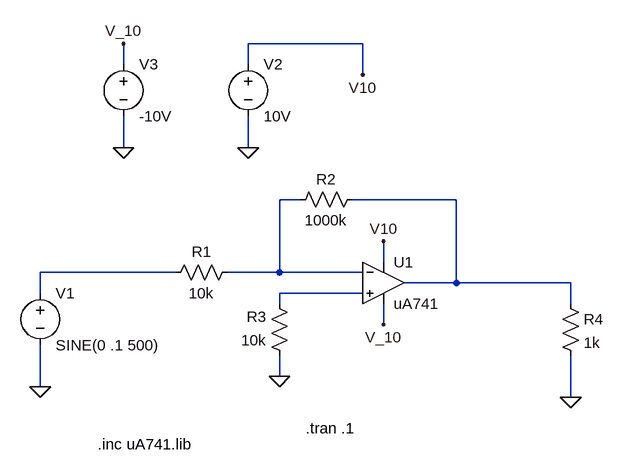
[diagram p0: schematic AOP2-uA741.asc]
AOP2-uA741.asc, the LTspice schematic file:
Version 4
SHEET 1 880 680
WIRE 432 -304 256 -304
WIRE 64 -272 64 -304
WIRE 256 -272 256 -304
WIRE 432 -256 432 -304
WIRE 64 -144 64 -192
WIRE 256 -144 256 -192
WIRE 336 -64 304 -64
WIRE 576 -64 416 -64
WIRE 464 32 464 0
WIRE 144 48 -64 48
WIRE 304 48 304 -64
WIRE 304 48 224 48
WIRE 432 48 304 48
WIRE 576 64 576 -64
WIRE 576 64 496 64
WIRE 752 64 576 64
WIRE -64 80 -64 48
WIRE 432 80 304 80
WIRE 304 96 304 80
WIRE 752 96 752 64
WIRE 464 128 464 96
WIRE 304 208 304 176
WIRE -64 224 -64 160
WIRE 752 240 752 176
FLAG -64 224 0
FLAG 256 -144 0
FLAG 64 -144 0
FLAG 752 240 0
FLAG 304 208 0
FLAG 432 -256 V10
FLAG 64 -304 V_10
FLAG 464 0 V10
FLAG 464 128 V_10
SYMBOL OpAmps\\opamp2 464 0 R0
SYMATTR InstName U1
SYMATTR Value uA741
SYMBOL voltage -64 64 R0
WINDOW 123 0 0 Left 0
WINDOW 39 0 0 Left 0
SYMATTR InstName V1
SYMATTR Value SINE(0 .1 500)
SYMBOL voltage 256 -288 R0
WINDOW 123 0 0 Left 0
WINDOW 39 0 0 Left 0
SYMATTR InstName V2
SYMATTR Value 10V
SYMBOL voltage 64 -288 R0
WINDOW 123 0 0 Left 0
WINDOW 39 0 0 Left 0
SYMATTR InstName V3
SYMATTR Value -10V
SYMBOL res 240 32 R90
WINDOW 0 0 56 VBottom 2
WINDOW 3 32 56 VTop 2
SYMATTR InstName R1
SYMATTR Value 10k
SYMBOL res 432 -80 R90
WINDOW 0 0 56 VBottom 2
WINDOW 3 32 56 VTop 2
SYMATTR InstName R2
SYMATTR Value 1000k
SYMBOL res 320 192 R180
WINDOW 0 36 76 Left 2
WINDOW 3 36 40 Left 2
SYMATTR InstName R3
SYMATTR Value 10k
SYMBOL res 736 80 R0
SYMATTR InstName R4
SYMATTR Value 1k
TEXT 24 312 Left 2 !.inc uA741.lib
TEXT 344 288 Left 2 !.tran .1

The netlist it stands for:
* AOP2-uA741.asc
XU1 N004 N001 V10 V_10 N002 uA741  ; pins In+ In- V+ V- OUT
V1 N003 0 SINE(0 .1 500)
V2 V10 0 10V
V3 V_10 0 -10V
R1 N001 N003 10k
R2 N002 N001 1000k
R3 0 N004 10k
R4 N002 0 1k
.inc uA741.lib
.tran .1
.backanno
.end